# Altium schematic sheet OT_LoRaWAN_Kit_02.SchDoc: Onethinx Devkit V2
size A4; DrawnBy: Rolf Nooteboom; DocumentNumber: 0010.00; SheetNumber: 1; SheetTotal: 1
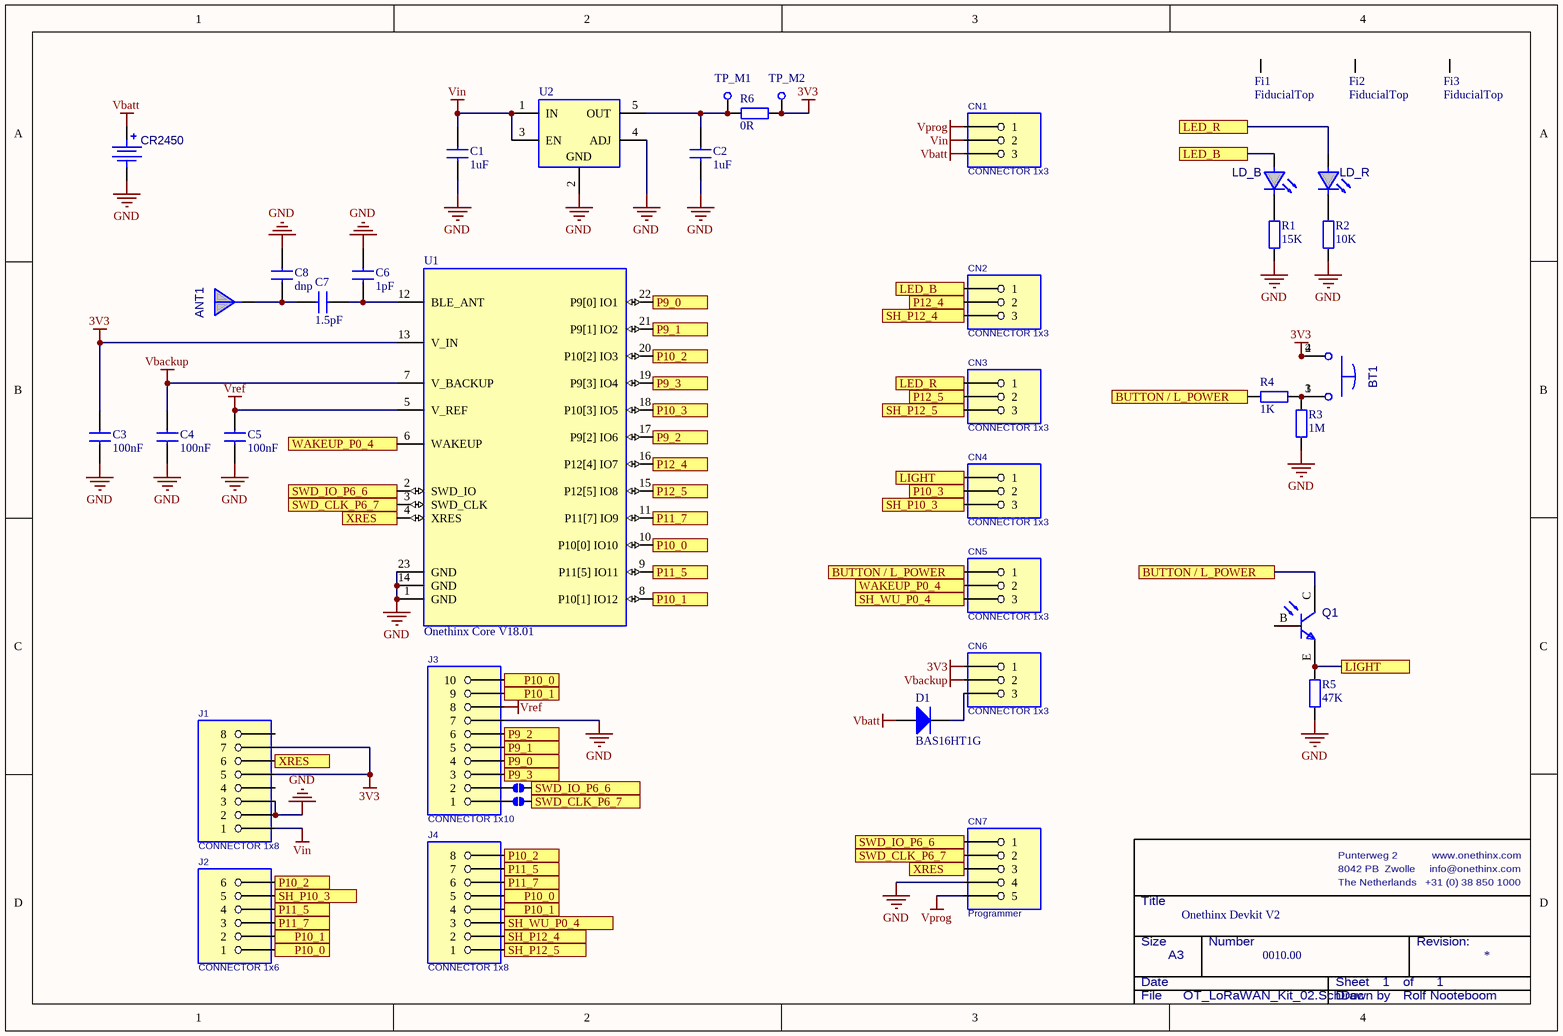
[diagram p0: OT_LoRaWAN_Kit_02.SchDoc]

## Parts
ANT1  ANT  [ANT FR05-S1-N-0-102]  (value not drawn)
BT1  BT P0_4  [BUTTON TACT6x6]  (value not drawn)
C1  1uF  [0603C-GENERIC]
C2  1uF  [0603C-GENERIC]
C3  100nF  [0603C-GENERIC]
C4  100nF  [0603C-GENERIC]
C5  100nF  [0603C-GENERIC]
C6  1pF  [0402C-SMALL]
C7  1.5pF  [0402C-SMALL]
C8  dnp  [0402C-SMALL]
CN1  CONNECTOR 1x3  [HEADER-1X3]
CN2  CONNECTOR 1x3  [HEADER-1X3]
CN3  CONNECTOR 1x3  [HEADER-1X3]
CN4  CONNECTOR 1x3  [HEADER-1X3]
CN5  CONNECTOR 1x3  [HEADER-1X3]
CN6  CONNECTOR 1x3  [HEADER-1X3]
CN7  Programmer  [CON Molex 22053051]
CR2450  BAT  [BATT_2450 clip - TH]  (value not drawn)
D1  BAS16HT1G  [SOD323]
Fi1  FiducialTop  [FiducialTop]  (no BOM)
Fi2  FiducialTop  [FiducialTop]  (no BOM)
Fi3  FiducialTop  [FiducialTop]  (no BOM)
J1  CONNECTOR 1x8  [SOCKET 2.54 1X8 TH]
J2  CONNECTOR 1x6  [SOCKET 2.54 1X6 TH]
J3  CONNECTOR 1x10  [SOCKET 2.54 1X10 TH]
J4  CONNECTOR 1x8  [SOCKET 2.54 1X8 TH]
JMP1  SWD to shield  [SOLDER JUMPER]  (value not drawn)  (no BOM)
JMP2  SWD to shield  [SOLDER JUMPER]  (value not drawn)  (no BOM)
LD_B  LD P12_4  [LED SMD 0603 (1608)]  (value not drawn)
LD_R  LD P12_5  [LED SMD 0603 (1608)]  (value not drawn)
Q1  Q1 P10_3  [PLCC-3_CEB]  (value not drawn)
R1  15K  [0603R-GENERIC]
R2  10K  [0603R-GENERIC]
R3  1M  [0603R-GENERIC]
R4  1K  [0603R-GENERIC]
R5  47K  [0603R-GENERIC]
R6  0R  [0603R-GENERIC]
TP_M1  TestPoint  [TestPoint 2mm]  (value not drawn)
TP_M2  TestPoint  [TestPoint 2mm]  (value not drawn)
U1  Onethinx Core V18.01  [OnethinxCore_18_01]
U2  TPS78330DDC  [SOT-23-5]  (value not drawn)

## Ports
BUTTON / L_POWER, LED_B, LED_R, LIGHT, P9_0, P9_1, P9_2, P9_3, P10_0, P10_1, P10_2, P10_3, P11_5, P11_7, P12_4, P12_5, SH_P10_3, SH_P12_4, SH_P12_5, SH_WU_P0_4, SWD_CLK_P6_7, SWD_IO_P6_6, WAKEUP_P0_4, XRES

## Nets
3V3: BT1.2 BT1.4 C3.2 CN6.1 J1.5 J1.7 R6.1 TP_M2.1 U1.13(V_IN)
GND: C1.1 C2.1 C3.1 C4.1 C5.1 C6.2 C8.2 CN7.4 CR2450.MINUS(Minus) J1.2 J1.3 J3.7 R1.1 R2.1 R3.1 R5.1 U1.1(GND) U1.14(GND) U1.23(GND) U2.2(GND) U2.4(ADJ)
Vbackup: C4.2 CN6.2 U1.7(V_BACKUP)
Vbatt: CN1.3 CR2450.PLUS(Plus) D1.A
Vin: C1.2 CN1.2 J1.1 U2.1(IN) U2.3(EN)
Vprog: CN1.1 CN7.5
Vref: C5.2 J3.8 U1.5(V_REF)
BUTTON / L_POWER: CN5.1 Q1.C R4.2 ; port BUTTON / L_POWER
LED_B: CN2.1 LD_B.A ; port LED_B
LED_R: CN3.1 LD_R.A ; port LED_R
LIGHT: CN4.1 Q1.E R5.2 ; port LIGHT
P9_0: J3.4 U1.22(P9[0]_IO1) ; port P9_0
P9_1: J3.5 U1.21(P9[1]_IO2) ; port P9_1
P9_2: J3.6 U1.17(P9[2]_IO6) ; port P9_2
P9_3: J3.3 U1.19(P9[3]_IO4) ; port P9_3
P10_0: J2.1 J3.10 J4.5 U1.10(P10[0]_IO10) ; port P10_0
P10_1: J2.2 J3.9 J4.4 U1.8(P10[1]_IO12) ; port P10_1
P10_2: J2.6 J4.8 U1.20(P10[2]_IO3) ; port P10_2
P10_3: CN4.2 U1.18(P10[3]_IO5) ; port P10_3
P11_5: J2.4 J4.7 U1.9(P11[5]_IO11) ; port P11_5
P11_7: J2.3 J4.6 U1.11(P11[7]_IO9) ; port P11_7
P12_4: CN2.2 U1.16(P12[4]_IO7) ; port P12_4
P12_5: CN3.2 U1.15(P12[5]_IO8) ; port P12_5
SH_P10_3: CN4.3 J2.5 ; port SH_P10_3
SH_P12_4: CN2.3 J4.2 ; port SH_P12_4
SH_P12_5: CN3.3 J4.1 ; port SH_P12_5
SH_WU_P0_4: CN5.3 J4.3 ; port SH_WU_P0_4
SWD_CLK_P6_7: CN7.2 JMP2.B U1.3(SWD_CLK) ; port SWD_CLK_P6_7
SWD_IO_P6_6: CN7.1 JMP1.B U1.2(SWD_IO) ; port SWD_IO_P6_6
WAKEUP_P0_4: CN5.2 U1.6(WAKEUP) ; port WAKEUP_P0_4
XRES: CN7.3 J1.6 U1.4(XRES) ; port XRES
NetANT1_ANT: ANT1.ANT C7.2 C8.1
NetBT1_1: BT1.1 BT1.3 R3.2 R4.1
NetC2_2: C2.2 R6.2 TP_M1.1 U2.5(OUT)
NetC6_1: C6.1 C7.1 U1.12(BLE_ANT)
NetCN6_3: CN6.3 D1.K
NetJ3_1: J3.1 JMP2.A
NetJ3_2: J3.2 JMP1.A
NetLD_B_K: LD_B.K R1.2
NetLD_R_K: LD_R.K R2.2

Not connected (* = marked no-connect by the designer): Fi1 A; Fi2 A; Fi3 A; J1 4 8; Q1 B

## Notes on the sheet
- Punterweg 2
- www.onethinx.com
- Title
- 8042 PB  Zwolle
- The Netherlands
- +31 (0) 38 850 1000
- info@onethinx.com
- Size
- Date
- A3
- Number
- Sheet
- of
- Revision:
- File
- Drawn by

## Library data of the parts
ANT1 = ANT: Antenna Fractus FR05-S1-N-0-102
BT1 = SW-TACT: FSM4JH
C1-C8 = CAP: Capacitor
CN1-CN6 = CONNECTOR 1x3: Harwin M20-9990345
CN7 = CONNECTOR 1x5: CON Molex 22053051
CR2450 = BAT: Battery
D1 = Diode
Fi1-Fi3 = FiducialTop: Fiducial Marker 1mm for Pick n Place
JMP1 = SolderJumper
JMP2 = SolderJumper: Solder Jumper
LD_B = LED: Wurth 150060BS73220
LD_R = LED: Wurth 150060RS75000
Q1 = Phototransistor: Phototransistor Vishay VEMT4700-GS08
R1-R6 = RES: Resistor
TP_M1 TP_M2 = TestPoint: Test Point
U1 = Onethinx_Core_18_01: PSoC Mixed Signal Array
U2 = Voltage Regulator_EN_ADJ